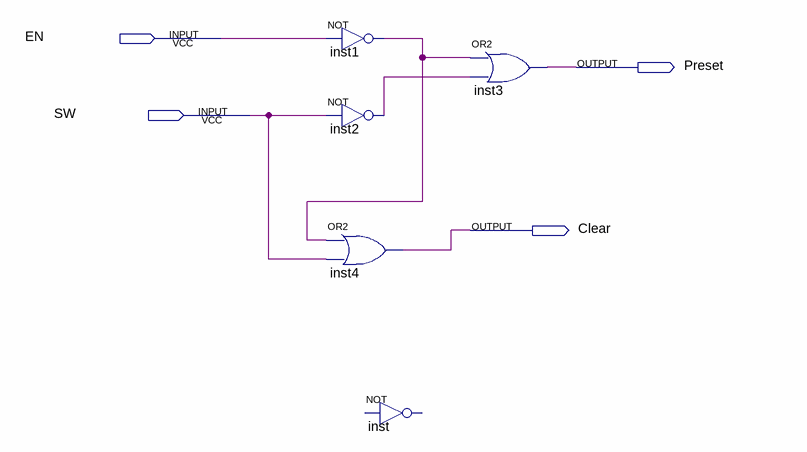
[diagram p0: schematic sheet]
// Quartus schematic NAP.bdf as structural Verilog: 5 symbols, 4 pins
module NAP (
  input  EN,
  input  SW,
  output Preset,
  output Clear
);

  wire inst1_out, inst2_out;

  not inst1 (inst1_out, EN);
  not inst2 (inst2_out, SW);
  or inst4 (Clear, inst1_out, SW);
  // NOT inst is placed but not wired
  or inst3 (Preset, inst1_out, inst2_out);
endmodule
